# Altium schematic sheet Commu02.SchDoc
size A4
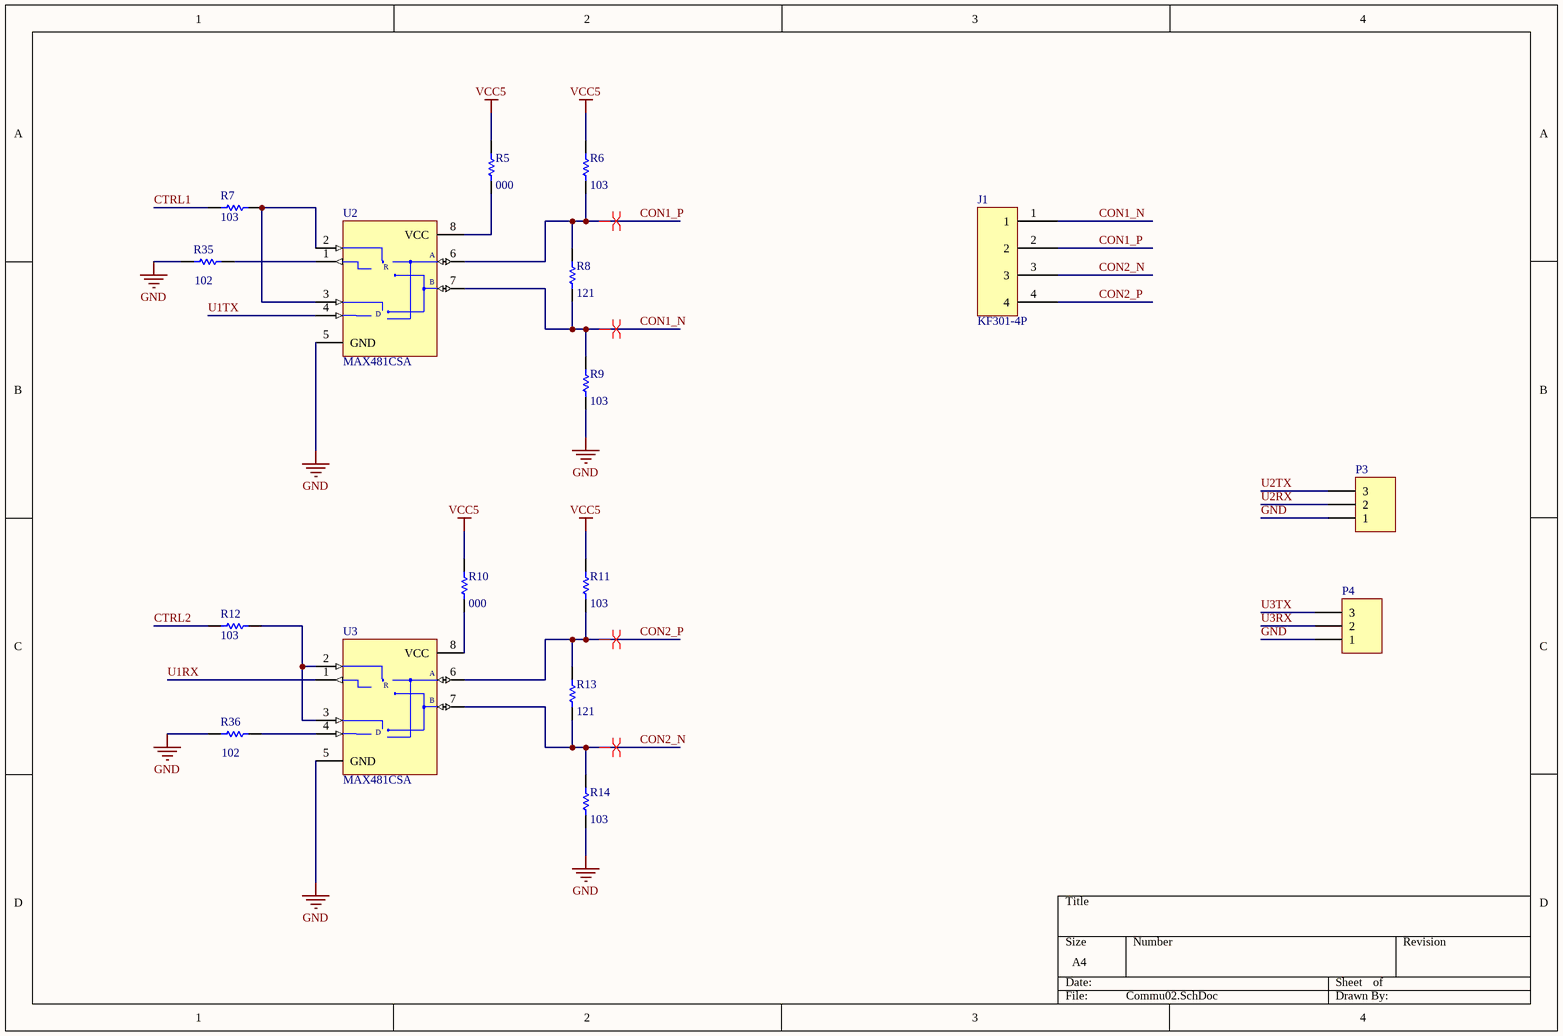
[diagram p0: Commu02.SchDoc]

## Parts
J1  KF301-4P  [KF301-4P]
P3  Header 3  [HDR1X3]  (value not drawn)
P4  Header 3  [HDR1X3]  (value not drawn)
R5  value 000  [1206]  (hidden comment: Res Semi)
R6  value 103  [1206]  (hidden comment: Res Semi)
R7  value 103  [1206]  (hidden comment: Res Semi)
R8  value 121  [1206]  (hidden comment: Res Semi)
R9  value 103  [1206]  (hidden comment: Res Semi)
R10  value 000  [1206]  (hidden comment: Res Semi)
R11  value 103  [1206]  (hidden comment: Res Semi)
R12  value 103  [1206]  (hidden comment: Res Semi)
R13  value 121  [1206]  (hidden comment: Res Semi)
R14  value 103  [1206]  (hidden comment: Res Semi)
R35  value 102  [1206]  (hidden comment: Res Semi)
R36  value 102  [1206]  (hidden comment: Res Semi)
U2  MAX481CSA  [NSO8_M]
U3  MAX481CSA  [NSO8_M]

## Nets
GND: P3.1 P4.1 R9.1 R14.1 R35.2 R36.2 U2.5(GND) U3.5(GND)
VCC5: R5.2 R6.2 R10.2 R11.2
CON1_N: J1.1 R8.1 R9.2 U2.7(B)
CON1_P: J1.2 R6.1 R8.2 U2.6(A)
CON2_N: J1.3 R13.1 R14.2 U3.7(B)
CON2_P: J1.4 R11.1 R13.2 U3.6(A)
CTRL1: R7.2
CTRL2: R12.2
U1RX: U3.1(RO)
U1TX: U2.4(DI)
U2RX: P3.2
U2TX: P3.3
U3RX: P4.2
U3TX: P4.3
NetR5_1: R5.1 U2.8(VCC)
NetR7_1: R7.1 U2.2(~{RE}) U2.3(DE)
NetR10_1: R10.1 U3.8(VCC)
NetR12_1: R12.1 U3.2(~{RE}) U3.3(DE)
NetR35_1: R35.1 U2.1(RO)
NetR36_1: R36.1 U3.4(DI)

## Layout directives
differential pair: CON1_N, CON1_P, CON2_N, CON2_P

## Notes on the sheet
- (in symbol MAX481CSA) R; D

## Library data of the parts
P3 P4 = Header 3: Header, 3-Pin; LatestRevisionDate: 17-Jul-2002; LatestRevisionNote: Re-released for DXP Platform.; Publisher: Altium Limited
R5-R14 R35 R36 = Res Semi: Semiconductor Resistor; Published: 8-Jun-2000; LatestRevisionDate: 17-Jul-2002; LatestRevisionNote: Re-released for DXP Platform.; PackageReference: AXIAL-0.5; Publisher: Altium Limited
U2 U3 = MAX481CSA: Low-Power, Slew-Rate-Limited RS-485/RS-422 Transceiver; Published: 16-Jan-2001; LatestRevisionDate: 13-Apr-2006; LatestRevisionNote: IPC-7351 Footprint Added.; DatasheetVersion: Feb-1996; PackageReference: NSO8; Publisher: Altium Limited; PackageDescription: 8-Pin Small Outline Integrated Circuit 1.27 mm Pitch; Code_JEDEC: MS-012-AA; Code_IPC: SOIC127P600-8; ComponentLink1Description: Manufacturer Link; ComponentLink1URL: http://www.maxim-ic.com/; ComponentLink2Description: Datasheet; ComponentLink2URL: http://pdfserv.maxim-ic.com/en/ds/MAX1487-MAX491.pdf